# EAGLE design STM8L_SensorsUnit (EAGLE 7.5.0)
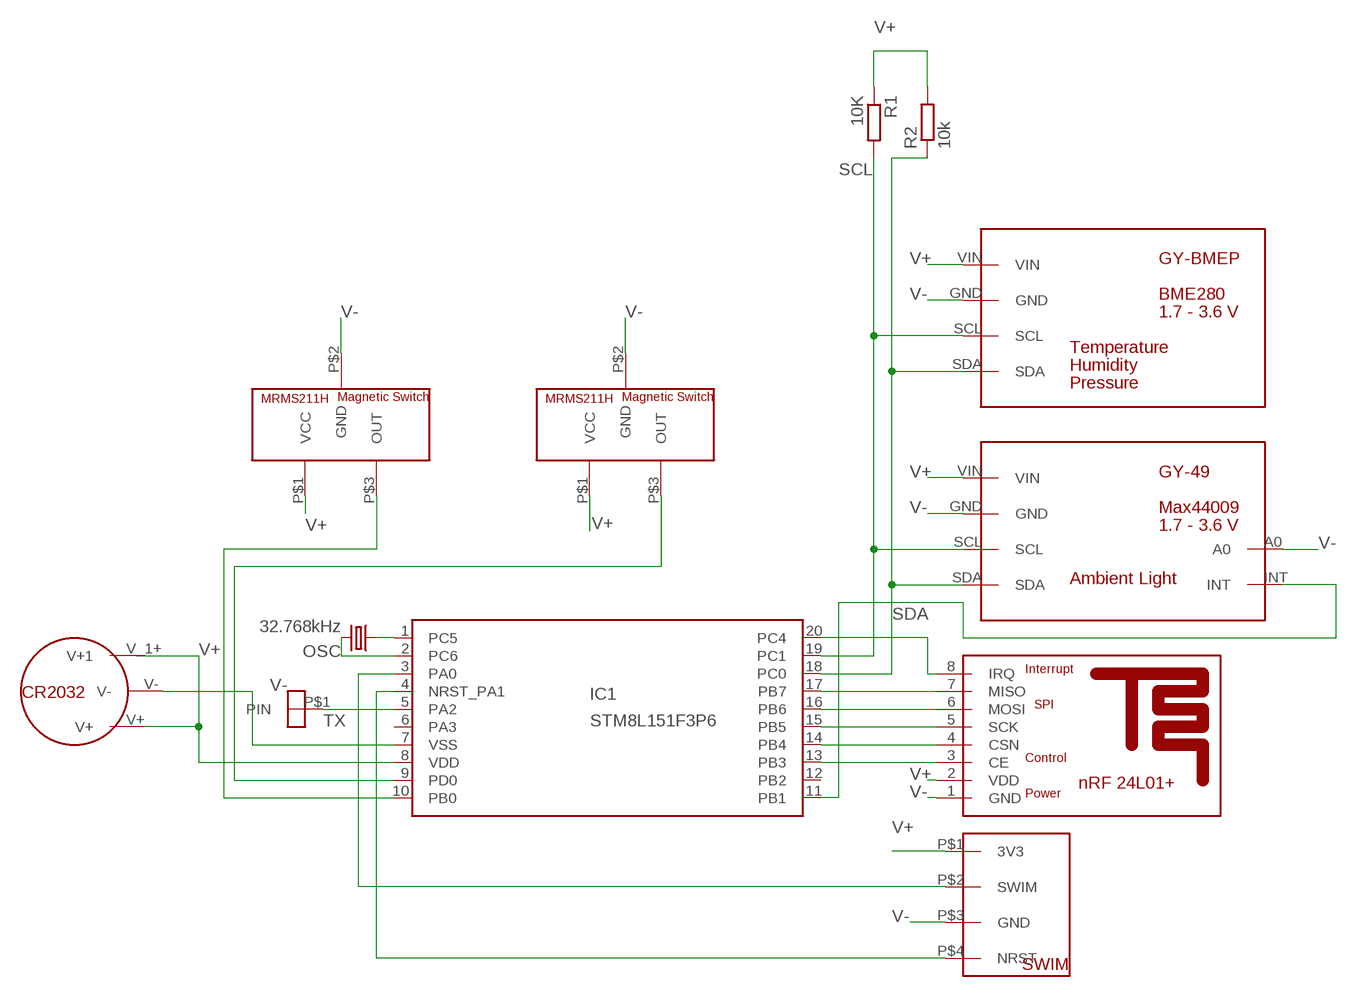
[diagram p0: schematic, sheet 1]

## Parts
IC1  STM8L151F3P6  [STM8L151F3P]
OSC  32.768kHz  CRYSTAL3.2X1.5MM  [CRYSTAL-SMD-3.2X1.5MM]
R1  10K  R-EU_M1206  [M1206]
R2  10k  R-EU_M1206  [M1206]
U$1  NRF24L01+REFDESIGNMINI  [NRF24L01+REFDESIGN-MINI]
U$2  GY-49G-49-SURF  [GY-49-SURF]
U$3  GY-BMEPGY-BMEP-NOHOLE  [GY-BMEP-NOHOLE]
U$4  MRMS211H-MAGNETIC-SWITCH  [3PIN-MM]
U$5  CR2032-ISOLATED  [CR2032-ISOLATED]
U$6  MRMS211H-MAGNETIC-SWITCH  [3PIN-MM]
U$7  SWIM  [SWIM]
U$8  PINSIGNAL  [PIN]

## Nets
N$4: IC1.16(PB6) U$1.6(MOSI)
N$6: IC1.14(PB4) U$1.4(CSN)
N$7: IC1.13(PB3) U$1.3(CE)
N$8: IC1.10(PB0) U$6.P$3(OUT)
N$9: IC1.9(PD0) U$4.P$3(OUT)
N$11: IC1.20(PC4) U$1.8(IRQ)
N$12: IC1.3(PA0) U$7.P$2(SWIM)
N$13: IC1.4(NRST_PA1) U$7.P$4(NRST)
N$14: IC1.1(PC5) OSC.P$1
N$15: IC1.11(PB1) U$2.INT
N$16: IC1.2(PC6) OSC.P$2
N$17: IC1.17(PB7) U$1.7(MISO)
N$19: IC1.15(PB5) U$1.5(SCK)
SCL: IC1.19(PC1) R1.2 U$2.SCL U$3.SCL
SDA: IC1.18(PC0) R2.1 U$2.SDA U$3.SDA
TX: IC1.5(PA2) U$8.P$1(PIN)
V+: IC1.8(VDD) R1.1 R2.2 U$1.2(VDD) U$2.VIN U$3.VIN U$4.P$1(VCC) U$5.V+ U$5.V_1+(V+1) U$6.P$1(VCC) U$7.P$1(3V3)
V-: IC1.7(VSS) U$1.1(GND) U$2.A0 U$2.GND U$3.GND U$4.P$2(GND) U$5.V- U$6.P$2(GND) U$7.P$3(GND)
Unconnected: IC1.6(PA3) IC1.12(PB2)

## Library data of the parts
IC1 = MySTM:STM8L151F3P6: edit this description Auto generated by make-symbol-device-package-bsdl.ulp Rev. 44 Source:
OSC = SparkFun-FreqCtrl:CRYSTAL: Various standard crystals. Proven footprints.; PROD_ID: XTAL-13062
R1 R2 = resistor:R-EU_: RESISTOR, European symbol
U$1 = nRF24L01+RefDesign:NRF24L01+REFDESIGN
U$2 = GY-49:GY-49
U$3 = GY-BMEP:GY-BMEP
U$4 U$6 = Sensors:MRMS211H-MAGNETIC-SWITCH
U$5 = wf-comp:CR2032-ISOLATED
U$7 = WFConnectors:SWIM
U$8 = WFConnectors:PINSIGNAL

## Board
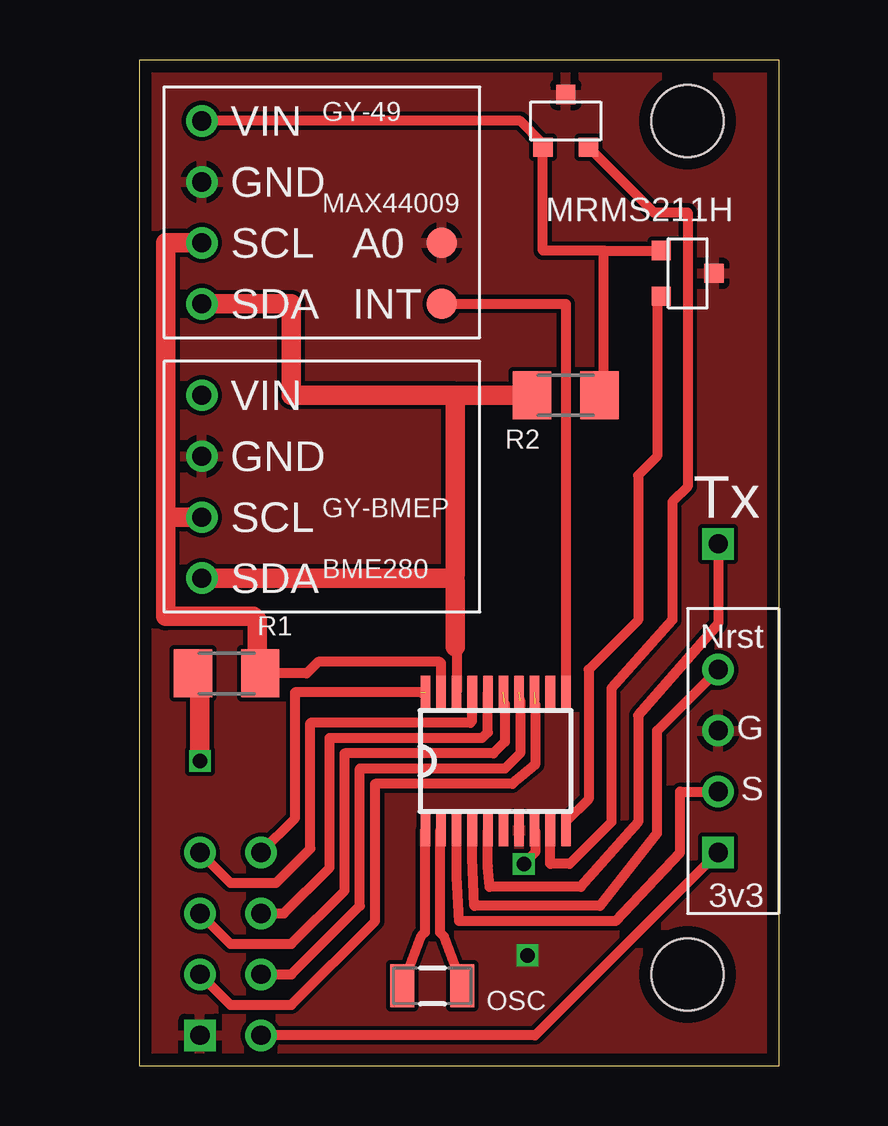
[diagram p1: board, top side]
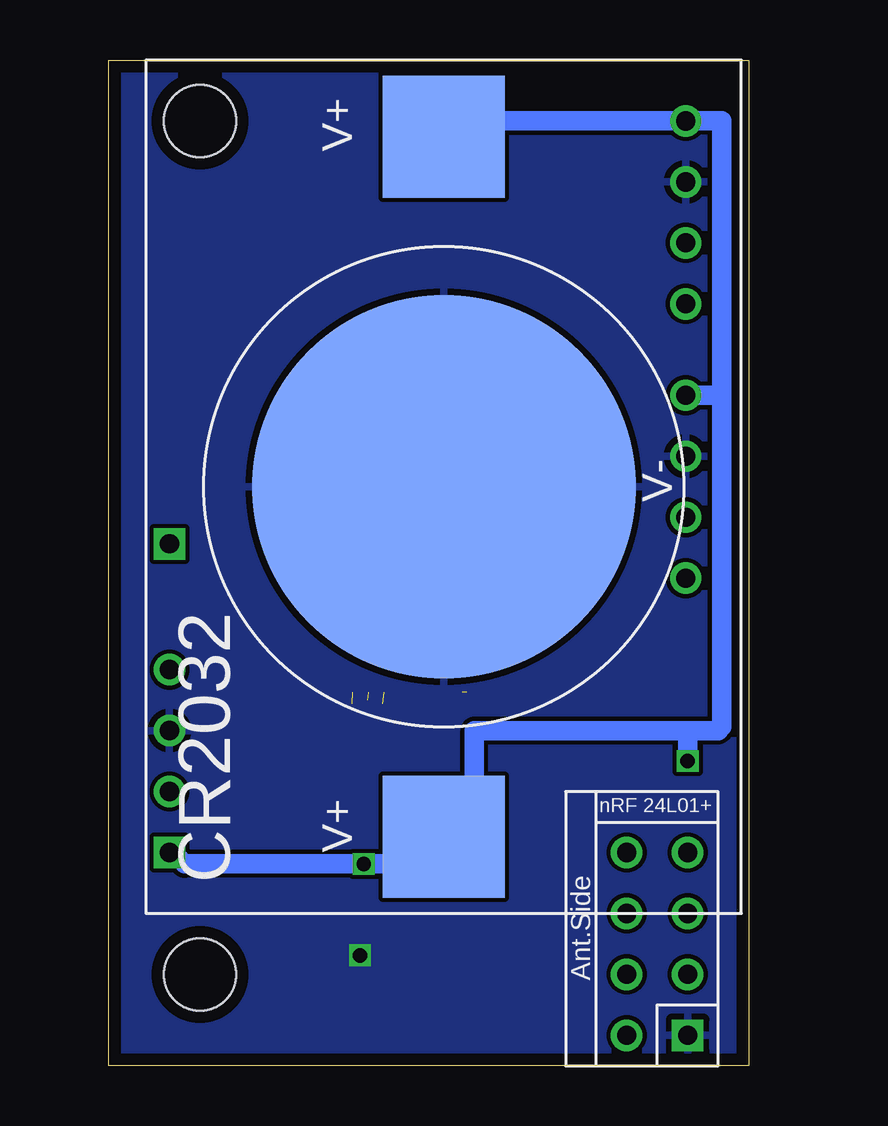
[diagram p2: board, bottom side, seen from below]

Size 26.67 x 41.9 mm. Coordinates in mm from the lower left corner, seen from the top.
Outline: 26.67,41.9 0,41.9 0,0 26.67,0 26.67,41.9
Copper layers (1*16): Top 0.035mm / dielectric 1.5mm / Bottom 0.035mm
Design rules "SmartPrototypingEagleRules": minimum track width 7mil, minimum drill 12mil, track to track 7mil, track to pad 7mil, pad to pad 7mil, via to via 7mil, smd to smd 0mil, copper to edge 20mil, drill to drill 10mil, minimum pad ring 10mil, minimum via ring 6mil, stop-mask expansion 2mil, vias tented up to drill 25mil, thermal gap 10mil
Holes 3 mm at 22.86,39.36 22.86,3.8

### Footprints (pad centres in the part's own frame; a part is rotated, then mirrored left to right if it is on the bottom)
STM8L151F3P = smd 1.35 x 0.4: 1 -2.875,2.925; 2 -2.875,2.275; 3 -2.875,1.625; 4 -2.875,0.975; 5 -2.875,0.325; 6 -2.875,-0.325; 7 -2.875,-0.975; 8 -2.875,-1.625; 9 -2.875,-2.275; 10 -2.875,-2.925; 11 2.875,-2.925; 12 2.875,-2.275; 13 2.875,-1.625; 14 2.875,-0.975; 15 2.875,-0.325; 16 2.875,0.325; 17 2.875,0.975; 18 2.875,1.625; 19 2.875,2.275; 20 2.875,2.925
CRYSTAL-SMD-3.2X1.5MM = smd 1 x 1.8: P$1 -1.25,0; P$2 1.25,0
M1206 = smd 1.6 x 2: 1 -1.4,0; 2 1.4,0
NRF24L01+REFDESIGN-MINI = drill 0.8 square: 1 -1.27,3.81 | drill 0.8: 2 1.27,3.81; 3 -1.27,1.27; 4 1.27,1.27; 5 -1.27,-1.27; 6 1.27,-1.27; 7 -1.27,-3.81; 8 1.27,-3.81
GY-49-SURF = smd 1.27 x 1.27: A0 5,-1.27; INT 5,-3.81 | drill 0.8: GND -5,1.27; SCL -5,-1.27; SDA -5,-3.81; VIN -5,3.81
GY-BMEP-NOHOLE = drill 0.8: GND -5,1.27; SCL -5,-1.27; SDA -5,-3.81; VIN -5,3.81
3PIN-MM = smd 0.8 x 0.8: P$1 -0.95,-1.1; P$2 0,1.1; P$3 0.95,-1.1
CR2032-ISOLATED = smd 5.08 x 5.08: V+ -14.59,0; V_1+ 14.59,0 | smd 16 x 16: V- 0,0
SWIM = drill 0.8 square: P$1 0,0 | drill 0.8: P$2 0,-2.54; P$3 0,-5.08; P$4 0,-7.62
PIN = drill 0.8 square: P$1 0,0

### Placement (x,y rotation side)
IC1  14.86,12.69 90 top
OSC  12.22,3.32 0 top
R1  3.65,16.34 0 top
R2  17.78,27.93 0 top
U$1  3.81,5.07 180 bottom
U$2  7.62,35.55 0 top
U$3  7.62,24.12 0 top
U$4  17.78,39.36 0 top
U$5  12.7,24.12 90 bottom
U$6  22.86,33.01 270 top
U$7  24.13,8.88 180 top
U$8  24.13,21.74 180 top

### Tracks (layer width: path | path; a pad name or v marks a point on that pad's centre or on a via)
N$4
  Top 0.406: U$1.6 6.03,6.34 7.94,8.25 7.94,13.64 14.29,13.64 14.53,13.89 IC1.16
N$6  (1 unrouted)
  Top 0.406: 15.88,15.23 15.88,13.01 15.24,12.37 9.21,12.37 9.21,6.66 6.35,3.8 U$1.4 5.4,3.8
N$7  (1 unrouted)
  Top 0.406: 16.51,15.07 16.51,12.53 15.56,11.74 9.84,11.74 9.84,6.02 6.35,2.53 3.81,2.53 U$1.3
N$8
  Top 0.406: U$6.P$3 21.59,31.89 21.59,25.39 20.8,24.6 20.8,18.56 18.73,16.5 18.73,11.1 17.78,10.15 IC1.10
N$9
  Top 0.406: IC1.9 17.13,8.42 17.14,8.4 17.94,8.4 19.68,10.15 19.68,15.71 22.23,18.56 22.23,23.48 22.86,24.12 22.86,35.55 21.44,35.55 U$4.P$3
N$11  (1 unrouted)
  Top 0.406: 11.75,15.55 6.51,15.55 6.51,10.31 U$1.8 5.24,8.88
N$12
  Top 0.406: IC1.3 13.23,7.87 13.34,6.02 19.84,6.02 22.54,8.88 22.54,11.42 U$7.P$2
N$13
  Top 0.406: IC1.4 13.88,8.63 13.97,6.66 19.21,6.66 21.59,9.67 21.59,13.96 U$7.P$4
N$14
  Top 0.406: IC1.1 11.91,9.79 11.91,5.55 11.75,5.39 OSC.P$1
N$15
  Top 0.406: U$2.INT 17.78,31.74 IC1.11
N$16
  Top 0.406: IC1.2 12.54,9.77 12.54,5.55 12.7,5.39 OSC.P$2
N$17
  Top 0.406: U$1.7 3.81,7.61 5.71,7.61 7.14,9.04 7.14,14.28 13.81,14.28 13.88,14.35 IC1.17
N$19  (1 unrouted)
  Top 0.406: U$1.5 3.81,5.07 6.35,5.07 8.57,7.29 8.57,13.01 14.76,13.01 15.24,13.48 15.24,15.07
SCL
  Top 0.406: IC1.19 12.58,16.77 12.54,16.82 7.46,16.82 6.99,16.34 R1.2
  Top 0.813: R1.2 4.92,16.47 4.92,18.56 4.76,18.72 1.11,18.72 1.11,22.85 | 1.11,22.85 U$3.SCL | U$2.SCL 1.11,34.28 1.11,22.85
SDA
  Top 0.406: 13.18,17.45 13.23,17.39 IC1.18
  Top 0.813: 13.18,17.45 13.18,20.15 13.02,20.31 | 13.02,20.31 U$3.SDA | U$2.SDA 6.35,31.74 6.35,27.93 13.18,27.93 | 13.02,20.31 13.18,20.47 13.18,27.93 | 13.18,27.93 R2.1
TX
  Top 0.406: U$8.P$1 24.13,18.4 20.8,14.6 20.8,10.15 18.41,7.45 14.61,7.45 14.53,8.32 IC1.5
V+  (via drill 0.6)
  Top 0.406: U$4.P$1 | R2.2 19.37,28.12 19.37,33.96 | 19.37,33.96 U$6.P$1 | U$4.P$1 16.83,38.41 15.88,39.36 U$2.VIN | IC1.8 16.51,9.79 16.51,8.88 v16.03,8.4 | 19.37,33.96 16.83,33.96 16.83,33.97 U$4.P$1 | U$7.P$1 16.51,1.26 U$1.2
  Top 0.813: R1.1 2.54,16.05 v2.54,12.69
  Bottom 0.813: U$5.V_1+ 12.05,39.36 U$2.VIN 1.11,39.36 1.11,27.93 | U$3.VIN 1.11,27.93 | U$7.P$1 23.97,8.88 23.5,8.4 v16.03,8.4 13.83,8.4 U$5.V+ 11.43,10.8 11.43,13.96 2.54,13.96 | 1.11,27.93 1.11,14.12 1.27,13.96 2.54,13.96 | v2.54,12.69 2.54,13.96
  Bottom 1.27: U$5.V_1+ 13.64,38.71 13.97,39.04
V-  (via drill 0.6)
  other vias: 16.19,4.59
  pour Bottom: 0,41.9 26.35,41.9 26.35,-0.01 0,-0.01
  pour Top: 0,41.9 26.35,41.9 26.35,-0.01 0,-0.01

### Text on the board
tPlace: MRMS211H | Tx